# Altium schematic sheet GoPro_Actuator_LED.SchDoc
size A
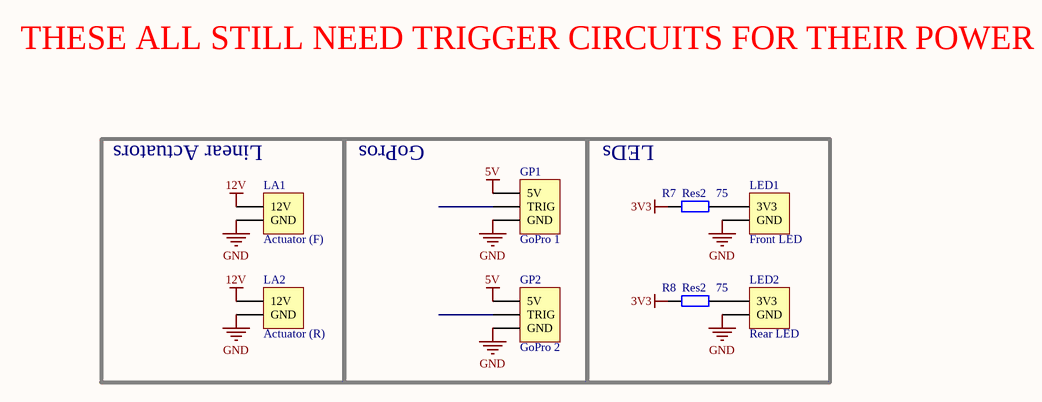
[diagram p0: GoPro_Actuator_LED.SchDoc]

## Parts
GP1  GoPro 1  [HDR1X3]
GP2  GoPro 2  [HDR1X3]
LA1  Actuator (F)  [HDR1X2]
LA2  Actuator (R)  [HDR1X2]
LED1  Front LED  [HDR1X2]
LED2  Rear LED  [HDR1X2]
R7  Res2  value 75  [AXIAL-0.4]
R8  Res2  value 75  [AXIAL-0.4]

## Blocks framed on the sheet
Linear Actuators: LA1 LA2
GoPros: GP1 GP2
LEDs: LED1 LED2 R7 R8

## Nets
3V3: R7.2 R8.2
5V: GP1.1(5V) GP2.1(5V)
12V: LA1.1(12V) LA2.1(12V)
GND: GP1.3(GND) GP2.3(GND) LA1.2(GND) LA2.2(GND) LED1.2(GND) LED2.2(GND)
NetLED1_1: LED1.1(3V3) R7.1
NetLED2_1: LED2.1(3V3) R8.1

Not connected (* = marked no-connect by the designer): GP1 2(TRIG); GP2 2(TRIG)

## Notes on the sheet
- THESE ALL STILL NEED TRIGGER CIRCUITS FOR THEIR POWER

## Library data of the parts
GP1 GP2 = Header 3: Header, 3-Pin; LatestRevisionDate: 17-Jul-2002; LatestRevisionNote: Re-released for DXP Platform.; Publisher: Altium Limited
LA1 LA2 LED1 LED2 = Header 2: Header, 2-Pin; LatestRevisionDate: 17-Jul-2002; LatestRevisionNote: Re-released for DXP Platform.; Publisher: Altium Limited
R7 R8 = Res2: Resistor; Published: 8-Jun-2000; LatestRevisionDate: 17-Jul-2002; LatestRevisionNote: Re-released for DXP Platform.; PackageReference: AXIAL-0.4; Publisher: Altium Limited; PackageDescription: Axial Device, Thru-Hole; 2 Leads; 0.4 in Pin Spacing